# Altium schematic sheet 10 FLASH_BOOT.SchDoc
size A2; ApprovedBy: DNP; CheckedBy: DNP; Author: DNP; CompanyName: Google LLC; DrawnBy: DNP; Organization: Google LLC; Address1: 1600 Amphitheatre Parkway; Address2: Mountain View, CA 94043; Address3: DNP; Address4: DNP; DocumentNumber: 10; SheetNumber: 10; SheetTotal: 17; VersionControl_RevNumber: DNP; IsUserConfigurable: DNP; Time: DNP; ImagePath: DNP; Rule: DNP; ProjectName: Enterprise; Application_BuildNumber: DNP
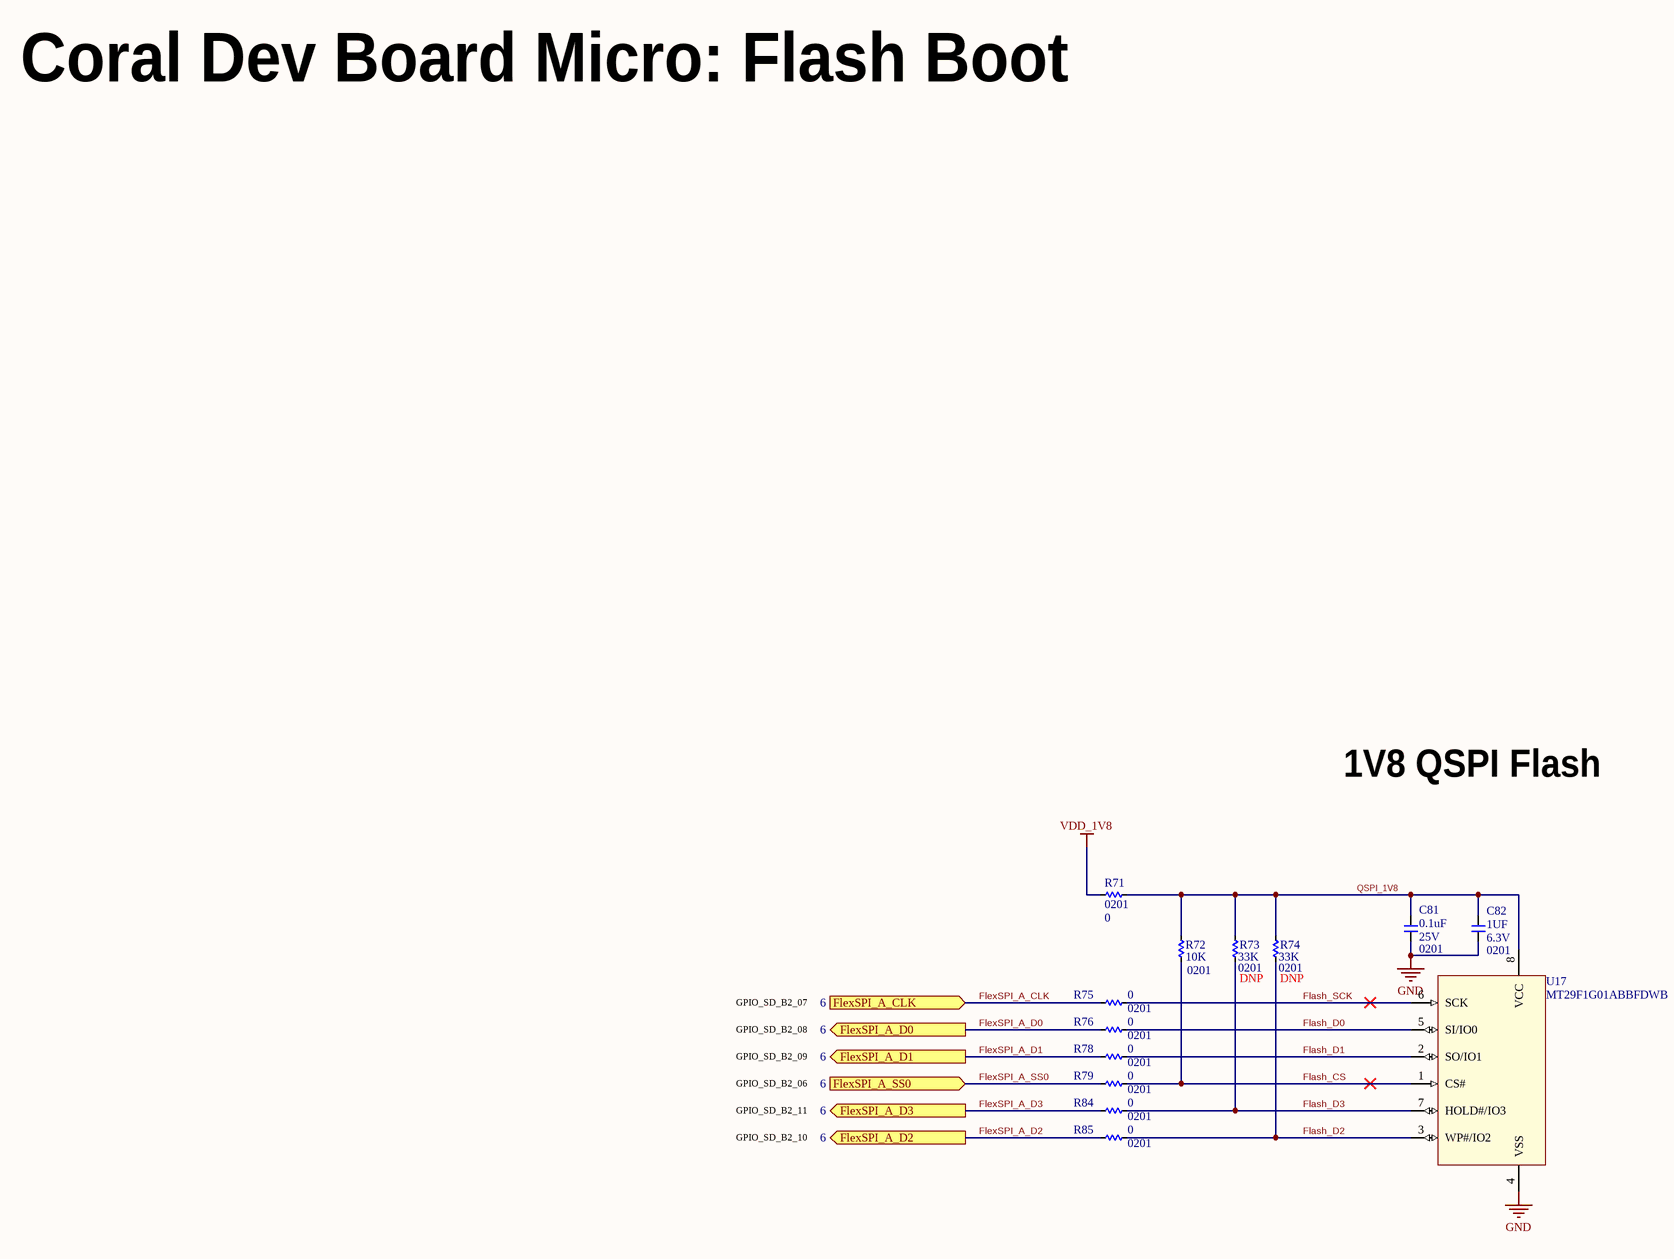
[diagram p0: 10 FLASH_BOOT.SchDoc]

## Parts
C81  value 0.1uF  Package: 0201  Voltage: 25V  [C0201Y]  (hidden comment: __Template_Cap)
C82  value 1UF  Package: 0201  Voltage: 6.3V  [C0201_H0.39MM]  (hidden comment: __Template_Cap)
R71  value 0  Package: 0201  [R0201]
R72  value 10K  Package: 0201  [R0201]
R73  value 33K  Package: 0201  [R0201]
R74  value 33K  Package: 0201  [R0201]
R75  value 0  Package: 0201  [R0201]
R76  value 0  Package: 0201  [R0201]
R78  value 0  Package: 0201  [R0201]
R79  value 0  Package: 0201  [R0201]
R84  value 0  Package: 0201  [R0201]
R85  value 0  Package: 0201  [R0201]
U17  MFG P/N: MT29F1G01ABBFDWB  [UDFN800X600X65-8]  (hidden comment: FLASH_MT29F1G01ABBFDWB)

## Ports
FlexSPI_A_CLK (in, see 6), FlexSPI_A_D0 (out, see 6), FlexSPI_A_D1 (out, see 6), FlexSPI_A_D2 (out, see 6), FlexSPI_A_D3 (out, see 6), FlexSPI_A_SS0 (in, see 6)

## Nets
GND: C81.2 C82.2 U17.4(VSS)
VDD_1V8: R71.2
Flash_CS: R72.1 R79.2 U17.1(CS#)
Flash_D0: R76.2 U17.5(SI/IO0)
Flash_D1: R78.2 U17.2(SO/IO1)
Flash_D2: R74.1 R85.2 U17.3(WP#/IO2)
Flash_D3: R73.1 R84.2 U17.7(HOLD#/IO3)
Flash_SCK: R75.2 U17.6(SCK)
FlexSPI_A_CLK: R75.1 ; port FlexSPI_A_CLK
FlexSPI_A_D0: R76.1 ; port FlexSPI_A_D0
FlexSPI_A_D1: R78.1 ; port FlexSPI_A_D1
FlexSPI_A_D2: R85.1 ; port FlexSPI_A_D2
FlexSPI_A_D3: R84.1 ; port FlexSPI_A_D3
FlexSPI_A_SS0: R79.1 ; port FlexSPI_A_SS0
QSPI_1V8: C81.1 C82.1 R71.1 R72.2 R73.2 R74.2 U17.8(VCC)

## Notes on the sheet
- Coral Dev Board Micro: Flash Boot
- 1V8 QSPI Flash
- GPIO_SD_B2_07
- GPIO_SD_B2_08
- GPIO_SD_B2_06
- GPIO_SD_B2_09
- GPIO_SD_B2_11
- GPIO_SD_B2_10
- Project:
- Engineer:
- Date:
- File:
- Revision:
- Sheet
- of

## Library data of the parts
C81 = 386: CAP, CER, X5R, 0.1uF, 25V, 20%, 0201, 0.33mm T; ID: 386; MFG: MURATA; MFG P/N: GRM033R61E104ME14D; XPN: 150-01204-00; Status: Released; Dielectric: X5R; Tolerance: 20%; Height: 0.33mm T; ComponentLink1Description: Datasheet; COMMON: 150-01204-00; LOON: 150-01204-00; Gecko: 150-01204-00
C82 = 1771: CAP, CER, X6S, 1uF, 20%, 6.3V, 0201, 0.39mm; ID: 1771; MFG: MURATA; MFG P/N: GRM033C80J105ME05D; EPIC: G150-02531-00; Status: In Development; Dielectric: X6S; Tolerance: 20%; Height: 0.39mm; Supplier 1: Digi-Key; HelpURL: https://www.digikey.com/product-detail/en/murata-electronics-north-america/GRM033C80J105ME05D/490-13218-1-ND/5877426; ComponentLink1Description: Datasheet; ComponentLink1URL: https://psearch.en.murata.com/capacitor/product/GRM033C80J105ME05%23.pdf; Supplier Part Number 1: 490-13218-1-ND
R71 R75 R76 R78 R79 R84 R85 = 8315: RES, 0.0, 1/20W, 0201; ID: 8315; MFG: PANASONIC; MFG P/N: ERJ1GN0R00C; Tolerance: JUMPER; COMMON: 470-00013-00; PROXY: Use ID #6940; Status: Released; Power: 1/20W; LOON: 470-00013-00; Gecko: 470-00013-00; XPN: 470-00013-00
R72 = 4151: RES, 10K, 1%, 1/20W, 0201; ID: 4151; MFG: YAGEO; MFG P/N: RC0201FR-0710KL; COMMON: 470-00033-00; PROXY: 470-16076-00; Status: Released; Power: 1/20W; Tolerance: 1%; Height: 0.26mm; Supplier 1: Digi-Key; LOON: 470-00033-00; Gecko: 470-00033-00; XPN: 470-00033-00; Supplier Part Number 1: 311-10.0KMCT-ND
R73 R74 = 8374: RES, 33K, 1%, 1/20W, 0201; ID: 8374; MFG: YAGEO; MFG P/N: RC0201FR-0733KL; COMMON: 470-00060-00; Status: Released; Power: 1/20W; Tolerance: 1%; LOON: 470-00060-00; Gecko: 470-00060-00; XPN: 470-00060-00; DNP: DNP
U17 = 428: IC, MEMORY, MT29F1G01ABB, NON-VOLATILE, FLASH, 1Gb(1G x 1), SPI, 1.7 TO 1.95V VIN, UDFN-8; ID: 428; MFG: Micron Technology Inc.; Status: Released; Package: 8-U-PDFN (8x6); Category: Integrated Circuits (ICs); RoHS Compliant: Yes; Supplier 1: Digi-Key; ComponentLink1Description: Datasheet; ComponentLink1URL: https://drive.google.com/file/d/1C-NTATQpKfaFS0xUlD5OwC7TQ7HH5Sp1/view; Mounting Type: SMD; Height: 0.65mm; Supplier Part Number 1: MT29F1G01ABBFDWB-IT:F-ND; HelpURL: https://www.digikey.com/en/products/detail/micron-technology-inc/mt29f1g01abbfdwb-it-f/7707445